# EAGLE schematic robot_wiring (EAGLE 7.4.0)
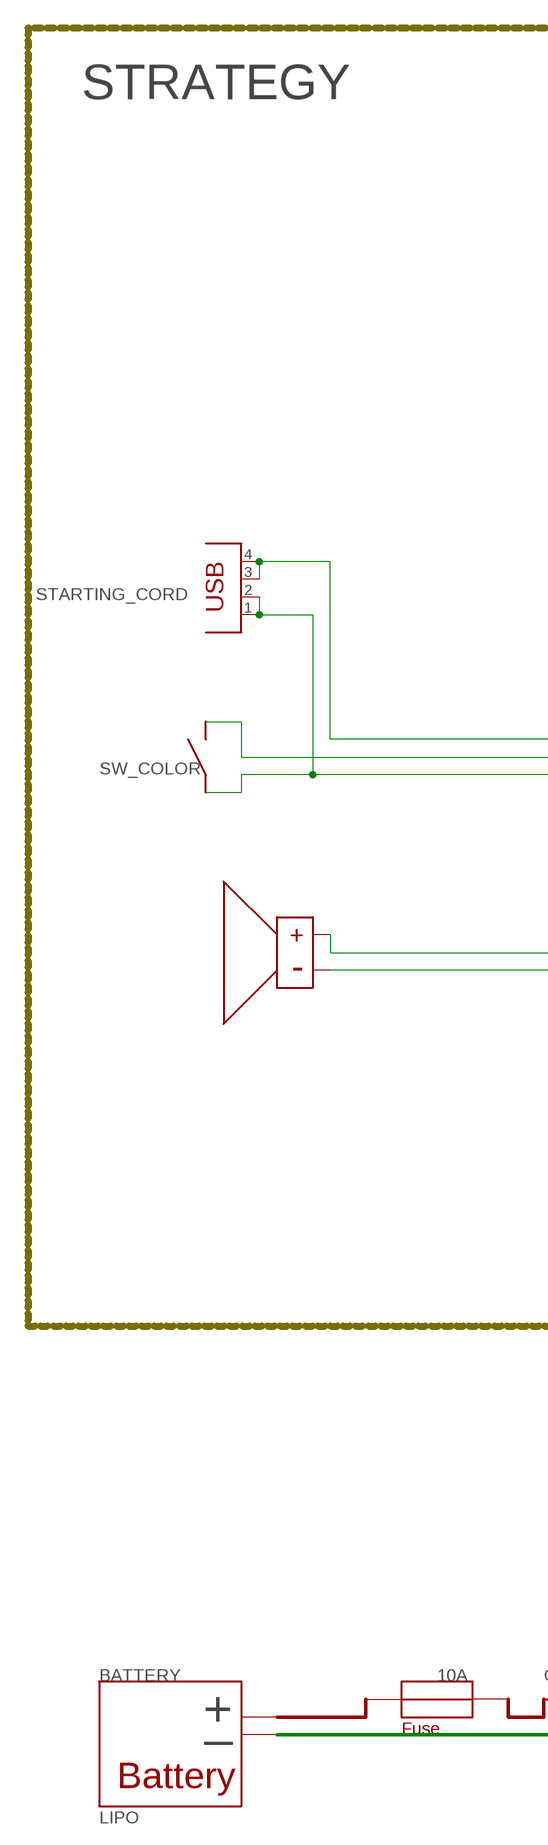
[diagram p0: schematic, sheet 1, part 1 of 3]
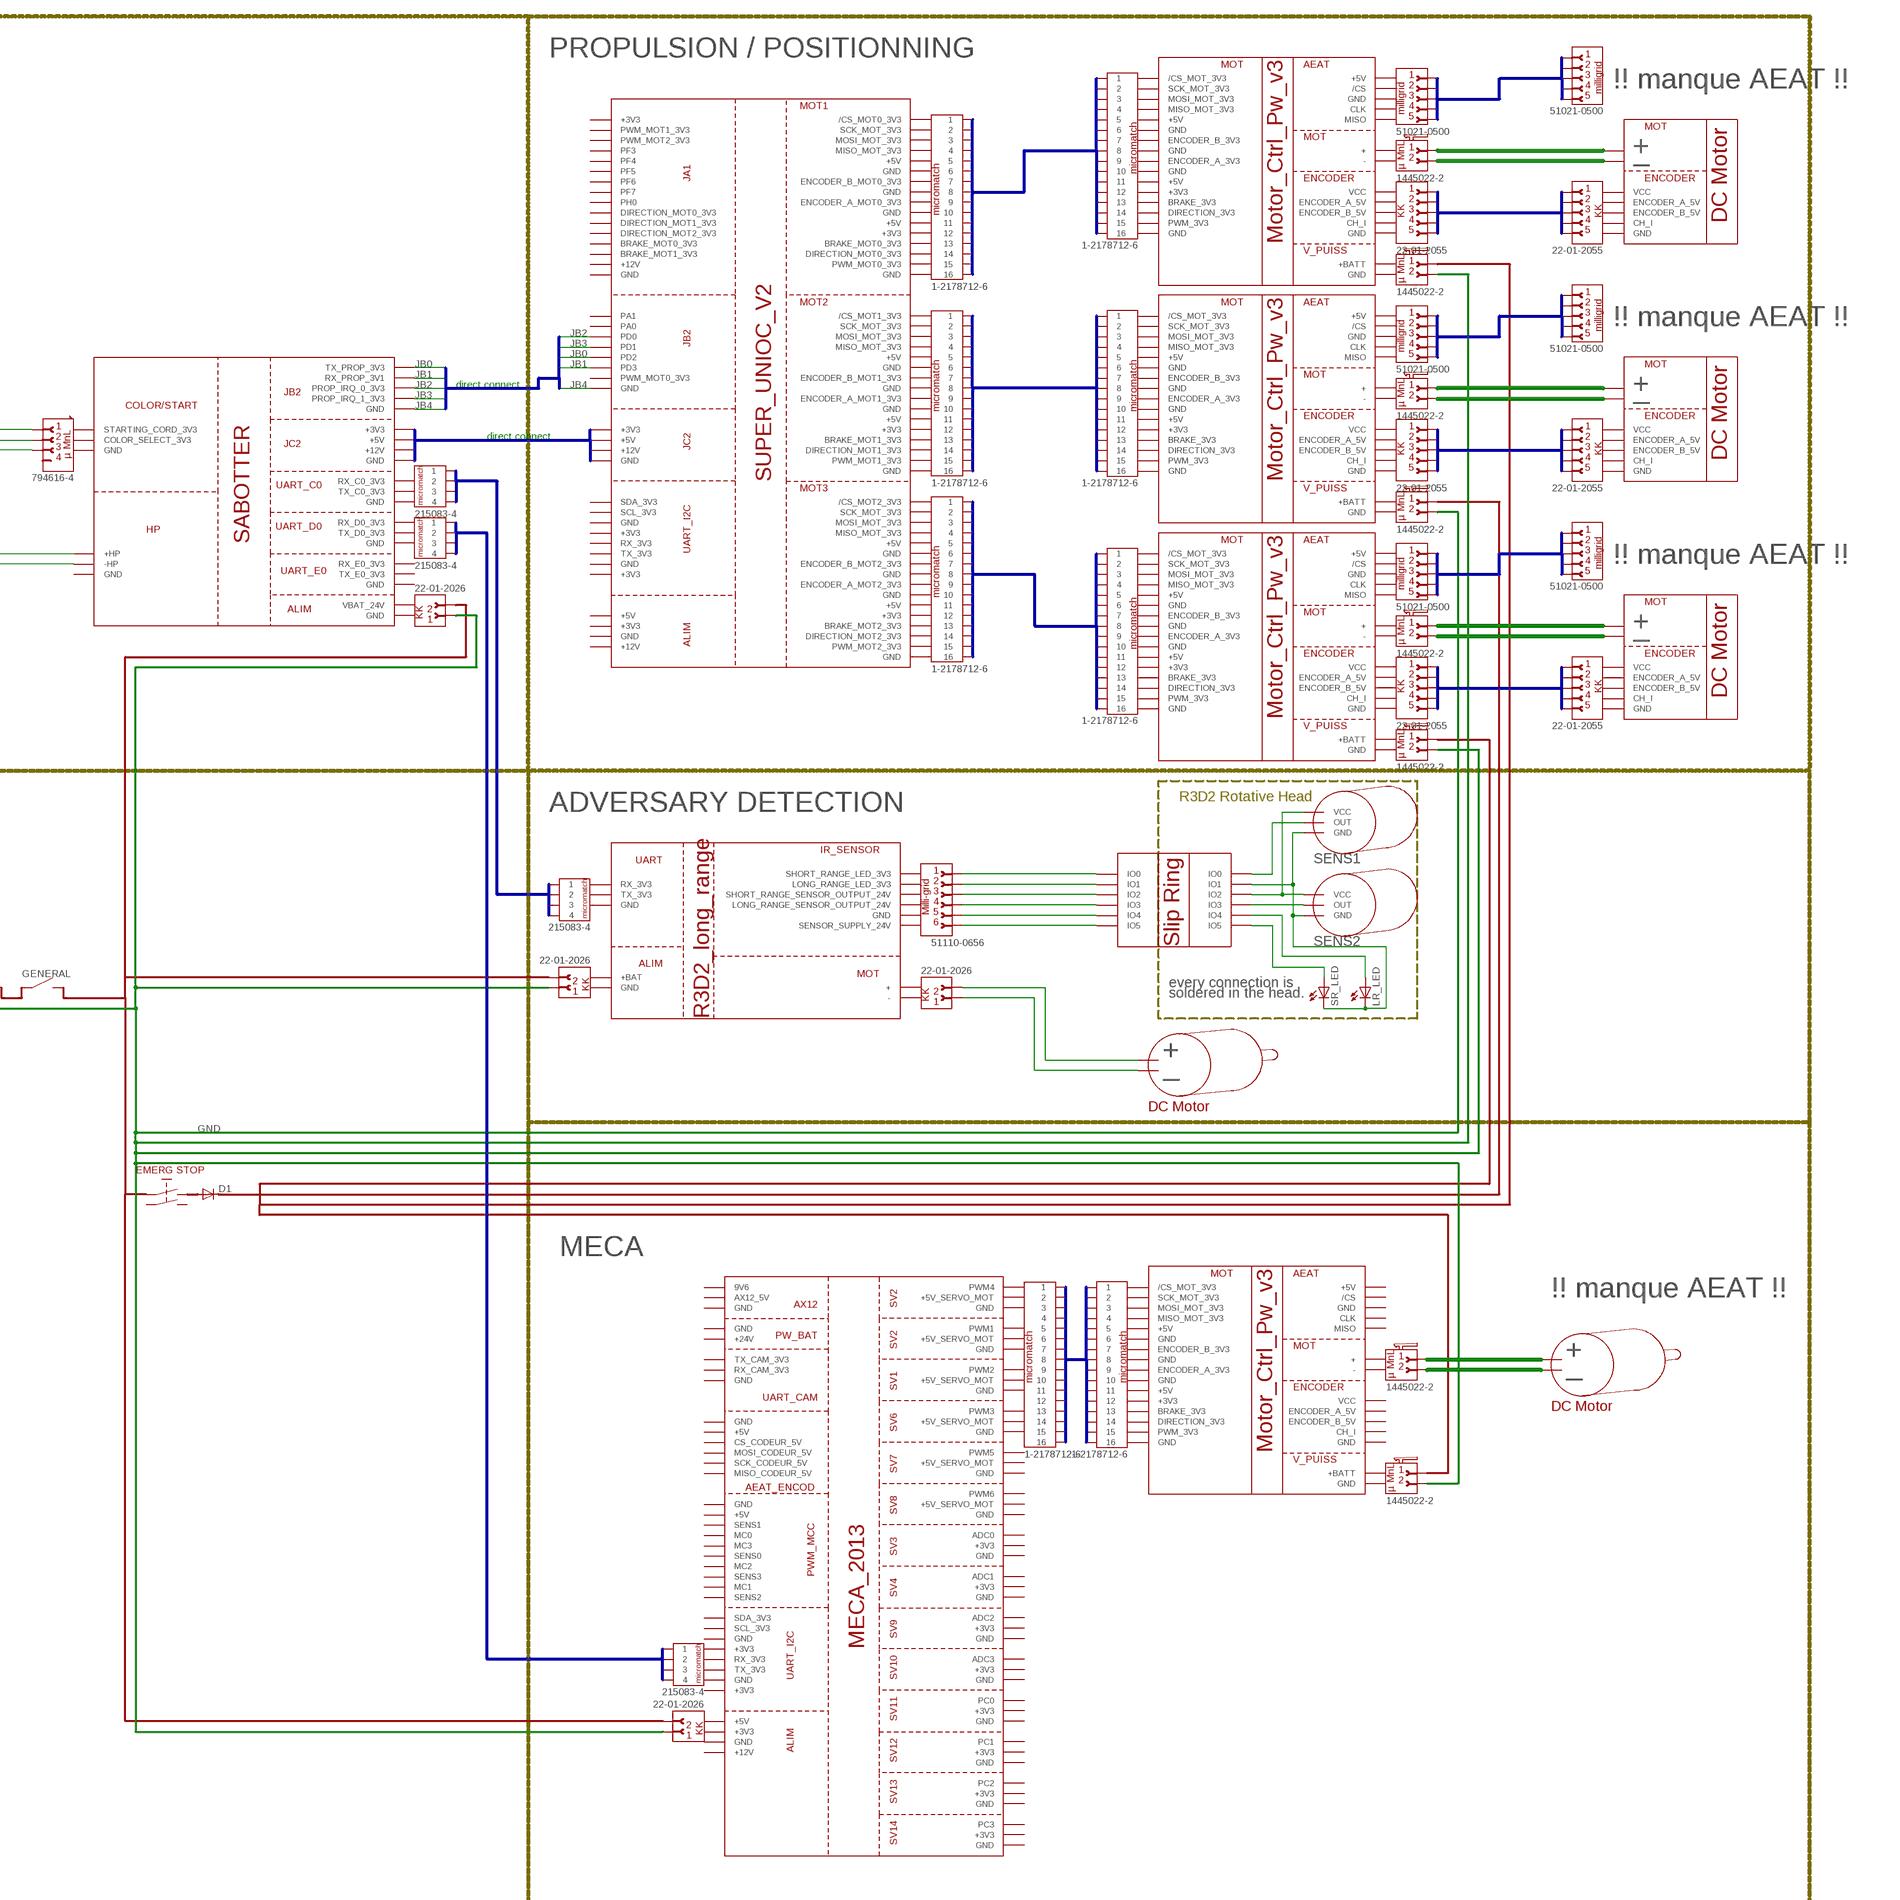
[diagram p1: schematic, sheet 1, part 2 of 3]
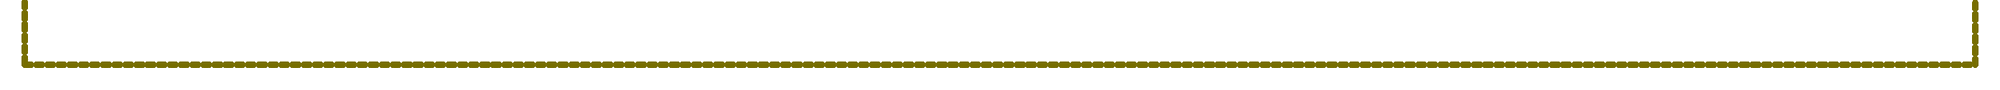
[diagram p2: schematic, sheet 1, part 3 of 3]
U$16 (51110-0656): MOUSER: 538-51110-0656; RS: 670-3590; _EXTERNAL_: 1
U$23 (22-01-2026): FARNELL: 143126; RS: 296-4934; _EXTERNAL_: 1
U$29 (22-01-2026): FARNELL: 143126; RS: 296-4934; _EXTERNAL_: 1
U$32 (22-01-2055): FARNELL: 146256; RS: 296-4962; _EXTERNAL_: 1
U$33 (22-01-2055): FARNELL: 146256; RS: 296-4962; _EXTERNAL_: 1
U$44 (22-01-2055): FARNELL: 146256; RS: 296-4962; _EXTERNAL_: 1
U$45 (22-01-2055): FARNELL: 146256; RS: 296-4962; _EXTERNAL_: 1
U$56 (22-01-2055): FARNELL: 146256; RS: 296-4962; _EXTERNAL_: 1
U$57 (22-01-2055): FARNELL: 146256; RS: 296-4962; _EXTERNAL_: 1
U$76 (1445022-2): FARNELL: 1111081; RS: 495-9063; _EXTERNAL_: 1
U$77 (22-01-2026): FARNELL: 143126; RS: 296-4934; _EXTERNAL_: 1
U$78 (1445022-2): FARNELL: 1111081; RS: 495-9063; _EXTERNAL_: 1
U$79 (1445022-2): FARNELL: 1111081; RS: 495-9063; _EXTERNAL_: 1
U$80 (1445022-2): FARNELL: 1111081; RS: 495-9063; _EXTERNAL_: 1
U$81 (1445022-2): FARNELL: 1111081; RS: 495-9063; _EXTERNAL_: 1
U$82 (1445022-2): FARNELL: 1111081; RS: 495-9063; _EXTERNAL_: 1
U$86 (794616-4): FARNELL: 1248309; RS: 680-2120; _EXTERNAL_: 1
U$107 (51021-0500): RS: 447-6580; _EXTERNAL_: 1
U$108 (51021-0500): RS: 447-6580; _EXTERNAL_: 1
U$119 (51021-0500): RS: 447-6580; _EXTERNAL_: 1
U$120 (51021-0500): RS: 447-6580; _EXTERNAL_: 1
U$131 (51021-0500): RS: 447-6580; _EXTERNAL_: 1
U$132 (51021-0500): RS: 447-6580; _EXTERNAL_: 1
U$147 (22-01-2026): FARNELL: 143126; RS: 296-4934; _EXTERNAL_: 1
U$153 (1445022-2): FARNELL: 1111081; RS: 495-9063; _EXTERNAL_: 1
U$154 (1445022-2): FARNELL: 1111081; RS: 495-9063; _EXTERNAL_: 1

## Parts
BATTERY  LIPO  BATTERY  (no package)
D1  DIODE-TO220H  [TO220AC]
GENERAL  SWITCH  (no package)
LR_LED  LED5MM  [LED5MM]
SR_LED  LED5MM  [LED5MM]
STARTING_CORD  PN61729  [PN61729]
SW_COLOR  SWITCH  (no package)
U$1  MAXXON_MOTOR  (no package)
U$2  MAXXON_MOTOR  (no package)
U$3  MAXXON_MOTOR  (no package)
U$4  MOTOR_CTRL_PW_V3  (no package)
U$5  MOTOR_CTRL_PW_V3  (no package)
U$6  MOTOR_CTRL_PW_V3  (no package)
U$7  SUPER_UNIOC  (no package)
U$8  SABOTTER  (no package)
U$9  R3D2_LONG_RANGE  (no package)
U$10  SPEAKER  (no package)
U$11  MECA_2013  (no package)
U$12  DC_MOTOR  (no package)
U$13  EMERGENCY_STOP  (no package)
U$14  DLIP_RING_6W  (no package)
U$17  50394-8051  (no package)
U$18  50394-8051  (no package)
U$19  50394-8051  (no package)
U$20  50394-8051  (no package)
U$21  50394-8051  (no package)
U$22  50394-8051  (no package)
U$24  08-50-0113  (no package)
U$25  08-50-0113  (no package)
U$26  DC_MOTOR  (no package)
U$27  08-50-0113  (no package)
U$28  08-50-0113  (no package)
U$30  08-50-0113  (no package)
U$31  08-50-0113  (no package)
U$34  08-50-0113  (no package)
U$35  08-50-0113  (no package)
U$36  08-50-0113  (no package)
U$37  08-50-0113  (no package)
U$38  08-50-0113  (no package)
U$39  08-50-0113  (no package)
U$40  08-50-0113  (no package)
U$41  08-50-0113  (no package)
U$42  08-50-0113  (no package)
U$43  08-50-0113  (no package)
U$46  08-50-0113  (no package)
U$47  08-50-0113  (no package)
U$48  08-50-0113  (no package)
U$49  08-50-0113  (no package)
U$50  08-50-0113  (no package)
U$51  08-50-0113  (no package)
U$52  08-50-0113  (no package)
U$53  08-50-0113  (no package)
U$54  08-50-0113  (no package)
U$55  08-50-0113  (no package)
U$58  08-50-0113  (no package)
U$59  08-50-0113  (no package)
U$60  08-50-0113  (no package)
U$61  08-50-0113  (no package)
U$62  08-50-0113  (no package)
U$63  08-50-0113  (no package)
U$64  08-50-0113  (no package)
U$65  08-50-0113  (no package)
U$66  08-50-0113  (no package)
U$67  08-50-0113  (no package)
U$68  215083-4  (no package)
U$69  215083-4  (no package)
U$70  1-2178712-6  (no package)
U$71  1-2178712-6  (no package)
U$72  1-2178712-6  (no package)
U$73  1-2178712-6  (no package)
U$74  1-2178712-6  (no package)
U$75  1-2178712-6  (no package)
U$83  MOTOR_CTRL_PW_V3  (no package)
U$84  1-2178712-6  (no package)
U$85  1-2178712-6  (no package)
U$87  1-794610-1  (no package)
U$88  1-794610-1  (no package)
U$89  1-794610-1  (no package)
U$90  1-794610-1  (no package)
U$91  1-794610-1  (no package)
U$92  1-794610-1  (no package)
U$93  1-794610-1  (no package)
U$94  1-794610-1  (no package)
U$99  1-794610-1  (no package)
U$100  1-794610-1  (no package)
U$101  1-794610-1  (no package)
U$102  1-794610-1  (no package)
U$103  1-794610-1  (no package)
U$104  1-794610-1  (no package)
U$105  1-794610-1  (no package)
U$109  50394-8051  (no package)
U$110  50394-8051  (no package)
U$111  50394-8051  (no package)
U$112  50394-8051  (no package)
U$113  50394-8051  (no package)
U$114  50394-8051  (no package)
U$115  50394-8051  (no package)
U$116  50394-8051  (no package)
U$117  50394-8051  (no package)
U$118  50394-8051  (no package)
U$121  50394-8051  (no package)
U$122  50394-8051  (no package)
U$123  50394-8051  (no package)
U$124  50394-8051  (no package)
U$125  50394-8051  (no package)
U$126  50394-8051  (no package)
U$127  50394-8051  (no package)
U$128  50394-8051  (no package)
U$129  50394-8051  (no package)
U$130  50394-8051  (no package)
U$133  50394-8051  (no package)
U$134  50394-8051  (no package)
U$135  50394-8051  (no package)
U$136  50394-8051  (no package)
U$137  50394-8051  (no package)
U$138  50394-8051  (no package)
U$139  50394-8051  (no package)
U$140  50394-8051  (no package)
U$141  50394-8051  (no package)
U$142  50394-8051  (no package)
U$143  215083-4  (no package)
U$144  215083-4  (no package)
U$145  08-50-0113  (no package)
U$146  08-50-0113  (no package)
U$155  1-794610-1  (no package)
U$156  1-794610-1  (no package)
U$157  1-794610-1  (no package)
U$158  1-794610-1  (no package)

## Nets
GND: BATTERY.- LR_LED.K(C) SR_LED.K(C) U$14.IO1 U$28.P$1 U$30.P$1 U$90.P$1 U$93.P$1 U$101.P$1 U$146.P$1 U$157.P$1 ; supply symbol labelled S15-PA-2-A00-NK
JB0: U$7.PD2 U$8.TX_PROP_3V3
JB1: U$7.PD3 U$8.RX_PROP_3V1
JB2: U$7.PD0 U$8.PROP_IRQ_0_3V3
JB3: U$7.PD1 U$8.PROP_IRQ_1_3V3
JB4: U$7.GND U$8.GND
N$1: U$1.+ U$99.P$1
N$2: U$1.- U$100.P$1
N$3: U$3.- U$87.P$1
N$4: U$3.+ U$88.P$1
N$5: U$2.- U$92.P$1
N$6: U$2.+ U$91.P$1
N$7: U$14.IO5 U$22.P$1
N$8: U$8.+HP U$10.P$1
N$9: U$8.-HP U$10.P$2
N$10: SW_COLOR.P$2 U$104.P$1
N$11: STARTING_CORD.1 STARTING_CORD.2 SW_COLOR.P$1 U$105.P$1
N$12: STARTING_CORD.3 STARTING_CORD.4 U$103.P$1
N$13: U$12.+ U$24.P$1
N$14: U$12.- U$25.P$1
N$16: U$14.IO4 U$21.P$1
N$17: U$14.IO3 U$20.P$1
N$18: U$14.IO2 U$19.P$1
N$19: U$14.IO0 U$17.P$1
N$20: U$14.IO1 U$18.P$1
N$21: LR_LED.A U$14.IO4
N$22: SR_LED.A U$14.IO5
N$23: U$14.IO0 ; supply symbol labelled S15-PA-2-A00-NK
N$24: U$14.IO3 ; supply symbol labelled S15-PA-2-A00-NK
N$25: U$26.+ U$155.P$1
N$26: U$26.- U$156.P$1
VCC: U$14.IO2 ; supply symbol labelled S15-PA-2-A00-NK
Unconnected: BATTERY.+ D1.A D1.C GENERAL.P$1 GENERAL.P$2 U$1.CH_I U$1.ENCODER_A_5V U$1.ENCODER_B_5V U$1.GND U$1.VCC U$2.CH_I U$2.ENCODER_A_5V U$2.ENCODER_B_5V U$2.GND U$2.VCC U$3.CH_I U$3.ENCODER_A_5V U$3.ENCODER_B_5V U$3.GND U$3.VCC U$4.+ U$4.+3V3 U$4.+5V U$4.+BATT U$4.- U$4./CS U$4./CS_MOT_3V3 U$4.BRAKE_3V3 U$4.CH_I U$4.CLK U$4.DIRECTION_3V3 U$4.ENCODER_A_3V3 U$4.ENCODER_A_5V U$4.ENCODER_B_3V3 U$4.ENCODER_B_5V U$4.GND U$4.MISO U$4.MISO_MOT_3V3 U$4.MOSI_MOT_3V3 U$4.PWM_3V3 U$4.SCK_MOT_3V3 U$4.VCC U$5.+ U$5.+3V3 U$5.+5V U$5.+BATT U$5.- U$5./CS U$5./CS_MOT_3V3 U$5.BRAKE_3V3 U$5.CH_I U$5.CLK U$5.DIRECTION_3V3 U$5.ENCODER_A_3V3 U$5.ENCODER_A_5V U$5.ENCODER_B_3V3 U$5.ENCODER_B_5V U$5.GND U$5.MISO U$5.MISO_MOT_3V3 U$5.MOSI_MOT_3V3 U$5.PWM_3V3 U$5.SCK_MOT_3V3 U$5.VCC U$6.+ U$6.+3V3 U$6.+5V U$6.+BATT U$6.- U$6./CS U$6./CS_MOT_3V3 U$6.BRAKE_3V3 U$6.CH_I U$6.CLK U$6.DIRECTION_3V3 U$6.ENCODER_A_3V3 U$6.ENCODER_A_5V U$6.ENCODER_B_3V3 U$6.ENCODER_B_5V U$6.GND U$6.MISO U$6.MISO_MOT_3V3 U$6.MOSI_MOT_3V3 U$6.PWM_3V3 U$6.SCK_MOT_3V3 U$6.VCC U$7.+3V3 U$7.+5V U$7.+12V U$7./CS_MOT0_3V3 U$7./CS_MOT1_3V3 U$7./CS_MOT2_3V3 U$7.BRAKE_MOT0_3V3 U$7.BRAKE_MOT1_3V3 U$7.BRAKE_MOT2_3V3 U$7.DIRECTION_MOT0_3V3 U$7.DIRECTION_MOT1_3V3 U$7.DIRECTION_MOT2_3V3 U$7.ENCODER_A_MOT0_3V3 U$7.ENCODER_A_MOT1_3V3 U$7.ENCODER_A_MOT2_3V3 U$7.ENCODER_B_MOT0_3V3 U$7.ENCODER_B_MOT1_3V3 U$7.ENCODER_B_MOT2_3V3 U$7.GND U$7.MISO_MOT_3V3 U$7.MOSI_MOT_3V3 U$7.PA0 U$7.PA1 U$7.PF3 U$7.PF4 U$7.PF5 U$7.PF6 U$7.PF7 U$7.PH0 U$7.PWM_MOT0_3V3 U$7.PWM_MOT1_3V3 U$7.PWM_MOT2_3V3 U$7.RX_3V3 U$7.SCK_MOT_3V3 U$7.SCL_3V3 U$7.SDA_3V3 U$7.TX_3V3 U$8.+3V3 U$8.+5V U$8.+12V U$8.COLOR_SELECT_3V3 U$8.GND U$8.RX_C0_3V3 U$8.RX_D0_3V3 U$8.RX_E0_3V3 U$8.STARTING_CORD_3V3 U$8.TX_C0_3V3 U$8.TX_D0_3V3 U$8.TX_E0_3V3 U$8.VBAT_24V U$9.+ U$9.+BAT U$9.- U$9.GND U$9.LONG_RANGE_LED_3V3 U$9.LONG_RANGE_SENSOR_OUTPUT_24V U$9.RX_3V3 U$9.SENSOR_SUPPLY_24V U$9.SHORT_RANGE_LED_3V3 U$9.SHORT_RANGE_SENSOR_OUTPUT_24V U$9.TX_3V3 U$11.9V6 U$11.+3V3 U$11.+5V U$11.+5V_SERVO_MOT U$11.+12V U$11.+24V U$11.ADC0 U$11.ADC1 U$11.ADC2 U$11.ADC3 U$11.AX12_5V U$11.CS_CODEUR_5V U$11.GND U$11.MC0 U$11.MC1 U$11.MC2 U$11.MC3 U$11.MISO_CODEUR_5V U$11.MOSI_CODEUR_5V U$11.PC0 U$11.PC1 U$11.PC2 U$11.PC3 U$11.PWM1 U$11.PWM2 U$11.PWM3 U$11.PWM4 U$11.PWM5 U$11.PWM6 U$11.RX_3V3 U$11.RX_CAM_3V3 U$11.SCK_CODEUR_5V U$11.SCL_3V3 U$11.SDA_3V3 U$11.SENS0 U$11.SENS1 U$11.SENS2 U$11.SENS3 U$11.TX_3V3 U$11.TX_CAM_3V3 U$13.P$1 U$13.P$2 U$13.P$3 U$13.P$4 U$27.P$1 U$31.P$1 U$34.P$1 U$35.P$1 U$36.P$1 U$37.P$1 U$38.P$1 U$39.P$1 U$40.P$1 U$41.P$1 U$42.P$1 U$43.P$1 U$46.P$1 U$47.P$1 U$48.P$1 U$49.P$1 U$50.P$1 U$51.P$1 U$52.P$1 U$53.P$1 U$54.P$1 U$55.P$1 U$58.P$1 U$59.P$1 U$60.P$1 U$61.P$1 U$62.P$1 U$63.P$1 U$64.P$1 U$65.P$1 U$66.P$1 U$67.P$1 U$68.1 U$68.2 U$68.3 U$68.4 U$69.1 U$69.2 U$69.3 U$69.4 U$70.1 U$70.2 U$70.3 U$70.4 U$70.5 U$70.6 U$70.7 U$70.8 U$70.9 U$70.10 U$70.11 U$70.12 U$70.13 U$70.14 U$70.15 U$70.16 U$71.1 U$71.2 U$71.3 U$71.4 U$71.5 U$71.6 U$71.7 U$71.8 U$71.9 U$71.10 U$71.11 U$71.12 U$71.13 U$71.14 U$71.15 U$71.16 U$72.1 U$72.2 U$72.3 U$72.4 U$72.5 U$72.6 U$72.7 U$72.8 U$72.9 U$72.10 U$72.11 U$72.12 U$72.13 U$72.14 U$72.15 U$72.16 U$73.1 U$73.2 U$73.3 U$73.4 U$73.5 U$73.6 U$73.7 U$73.8 U$73.9 U$73.10 U$73.11 U$73.12 U$73.13 U$73.14 U$73.15 U$73.16 U$74.1 U$74.2 U$74.3 U$74.4 U$74.5 U$74.6 U$74.7 U$74.8 U$74.9 U$74.10 U$74.11 U$74.12 U$74.13 U$74.14 U$74.15 U$74.16 U$75.1 U$75.2 U$75.3 U$75.4 U$75.5 U$75.6 U$75.7 U$75.8 U$75.9 U$75.10 U$75.11 U$75.12 U$75.13 U$75.14 U$75.15 U$75.16 U$83.+ U$83.+3V3 U$83.+5V U$83.+BATT U$83.- U$83./CS U$83./CS_MOT_3V3 U$83.BRAKE_3V3 U$83.CH_I U$83.CLK U$83.DIRECTION_3V3 U$83.ENCODER_A_3V3 U$83.ENCODER_A_5V U$83.ENCODER_B_3V3 U$83.ENCODER_B_5V U$83.GND U$83.MISO U$83.MISO_MOT_3V3 U$83.MOSI_MOT_3V3 U$83.PWM_3V3 U$83.SCK_MOT_3V3 U$83.VCC U$84.1 U$84.2 U$84.3 U$84.4 U$84.5 U$84.6 U$84.7 U$84.8 U$84.9 U$84.10 U$84.11 U$84.12 U$84.13 U$84.14 U$84.15 U$84.16 U$85.1 U$85.2 U$85.3 U$85.4 U$85.5 U$85.6 U$85.7 U$85.8 U$85.9 U$85.10 U$85.11 U$85.12 U$85.13 U$85.14 U$85.15 U$85.16 U$89.P$1 U$94.P$1 U$102.P$1 U$109.P$1 U$110.P$1 U$111.P$1 U$112.P$1 U$113.P$1 U$114.P$1 U$115.P$1 U$116.P$1 U$117.P$1 U$118.P$1 U$121.P$1 U$122.P$1 U$123.P$1 U$124.P$1 U$125.P$1 U$126.P$1 U$127.P$1 U$128.P$1 U$129.P$1 U$130.P$1 U$133.P$1 U$134.P$1 U$135.P$1 U$136.P$1 U$137.P$1 U$138.P$1 U$139.P$1 U$140.P$1 U$141.P$1 U$142.P$1 U$143.1 U$143.2 U$143.3 U$143.4 U$144.1 U$144.2 U$144.3 U$144.4 U$145.P$1 U$158.P$1

## Buses
B$1
B$4
B$5
B$6
JB[0..4]
B$8
B$7
B$2

## Notes on the sheet
- STRATEGY | PROPULSION / POSITIONNING
- !! manque AEAT !!
- !! manque AEAT !!
- direct connect
- direct connect
- !! manque AEAT !!
- R3D2 Rotative Head
- ADVERSARY DETECTION
- every connection is
- soldered in the head.
- MECA
- !! manque AEAT !!

## Library data of the parts
BATTERY = robotter_wiring:BATTERY; _EXTERNAL_: 1
D1 = diode:DIODE-: DIODE
GENERAL SW_COLOR = robotter_wiring:SWITCH; _EXTERNAL_: 1
LR_LED SR_LED = led:LED: LED OSRAM: - CHIPLED LG R971, LG N971, LY N971, LG Q971, LY Q971, LO R971, LY R971 LH N974, LH R974 LS Q976, LO Q976, LY Q976 LO Q996 - Hyper CHIPLED LW Q18S LB Q993, LB Q99A, LB R99A - SideLED LS A670, LO A670, LY A670, LG A670, LP A670 LB A673, LV A673, LT A673, LW A673 LH A674 LY A675 LS A676, LA A676, LO A676, LY A676, LW A676 LS A679, LY A679, LG A679 - Hyper Micro SIDELED® LS Y876, LA Y876, LO Y876, LY Y876 LT Y87S - SmartLED LW L88C, LW L88S LB L89C, LB L89S, LG L890 LS L89K, LO L89K, LY L89K LS L896, LA L896, LO L896, LY L896 - TOPLED LS T670, LO T670, LY T670, LG T670, LP T670 LSG T670, LSP T670, LSY T670, LOP T670, LYG T670 LG T671, LOG T671, LSG T671 LB T673, LV T673, LT T673, LW T673 LH T674 LS T676, LA T676, LO T676, LY T676, LB T676, LH T676, LSB T676, LW T676 LB T67C, LV T67C, LT T67C, LS T67K, LO T67K, LY T67K, LW E67C LS E67B, LA E67B, LO E67B, LY E67B, LB E67C, LV E67C, LT E67C LW T67C LS T679, LY T679, LG T679 LS T770, LO T770, LY T770, LG T770, LP T770 LB T773, LV T773, LT T773, LW T773 LH T774 LS E675, LA E675, LY E675, LS T675 LS T776, LA T776, LO T776, LY T776, LB T776 LHGB T686 LT T68C, LB T68C - Hyper Mini TOPLED® LB M676 - Mini TOPLED Santana® LG M470 LS M47K, LO M47K, LY M47K Source: http://www.osram.convergy.de LUXEON: - LUMILED® LXK2-PW12-R00, LXK2-PW12-S00, LXK2-PW14-U00, LXK2-PW14-V00 LXK2-PM12-R00, LXK2-PM12-S00, LXK2-PM14-U00 LXK2-PE12-Q00, LXK2-PE12-R00, LXK2-PE12-S00, LXK2-PE14-T00, LXK2-PE14-U00 LXK2-PB12-K00, LXK2-PB12-L00, LXK2-PB12-M00, LXK2-PB14-N00, LXK2-PB14-P00, LXK2-PB14-Q00 LXK2-PR12-L00, LXK2-PR12-M00, LXK2-PR14-Q00, LXK2-PR14-R00 LXK2-PD12-Q00, LXK2-PD12-R00, LXK2-PD12-S00 LXK2-PH12-R00, LXK2-PH12-S00 LXK2-PL12-P00, LXK2-PL12-Q00, LXK2-PL12-R00 Source: www.luxeon.com KINGBRIGHT: KA-3528ASYC Source: www.kingbright.com
STARTING_CORD = con-berg:PN61729: BERG USB connector; OC_FARNELL: unknown; OC_NEWARK: unknown
U$1-U$3 = robotter_wiring:MAXXON_MOTOR; _EXTERNAL_: 1
U$4-U$6 U$83 = robotter_wiring:MOTOR_CTRL_PW_V3; _EXTERNAL_: 1
U$7 = robotter_wiring:SUPER_UNIOC; _EXTERNAL_: 1
U$8 = robotter_wiring:SABOTTER; _EXTERNAL_: 1
U$9 = robotter_wiring:R3D2_LONG_RANGE; _EXTERNAL_: 1
U$10 = robotter_wiring:SPEAKER; _EXTERNAL_: 1
U$11 = robotter_wiring:MECA_2013; _EXTERNAL_: 1
U$12 U$26 = robotter_wiring:DC_MOTOR; _EXTERNAL_: 1
U$13 = robotter_wiring:EMERGENCY_STOP; _EXTERNAL_: 1
U$14 = robotter_wiring:DLIP_RING_6W; _EXTERNAL_: 1
U$17-U$22 U$109-U$118 U$121-U$130 U$133-U$142 = robotter_wiring:50394-8051: Milli-grid contact - 24-30AWG - crimp terminal; FARNELL: 2293846; RS: 670-6432; _EXTERNAL_: 1
U$24 U$25 U$27 U$28 U$30 U$31 U$34-U$43 U$46-U$55 U$58-U$67 U$145 U$146 = robotter_wiring:08-50-0113: mini KK crimp terminal - 22-30AWG; FARNELL: 2063734; RS: 172-9178; _EXTERNAL_: 1
U$68 U$69 U$143 U$144 = robotter_wiring:215083-4: micromatch male on wire connecter - 4 contacts; FARNELL: 2473375; RS: 680-5135; _EXTERNAL_: 1
U$70-U$75 U$84 U$85 = robotter_wiring:1-2178712-6: MICROMATCH 16 contacts male on wire connector; FARNELL: 2473381; RS: 847-5566; _EXTERNAL_: 1
U$87-U$94 U$99-U$105 U$155-U$158 = robotter_wiring:1-794610-1: Micro Mat N Lok crimp terminal - 20 -24 AWG - receptacle; FARNELL: 1339224; RS: 680-1433; _EXTERNAL_: 1